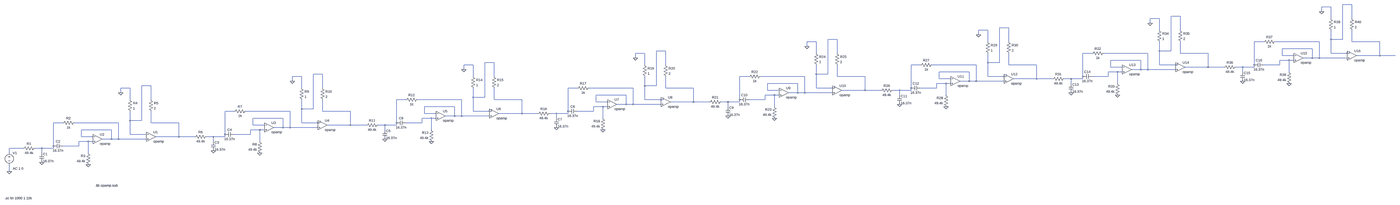
[diagram p0: schematic filter.asc, whole sheet]
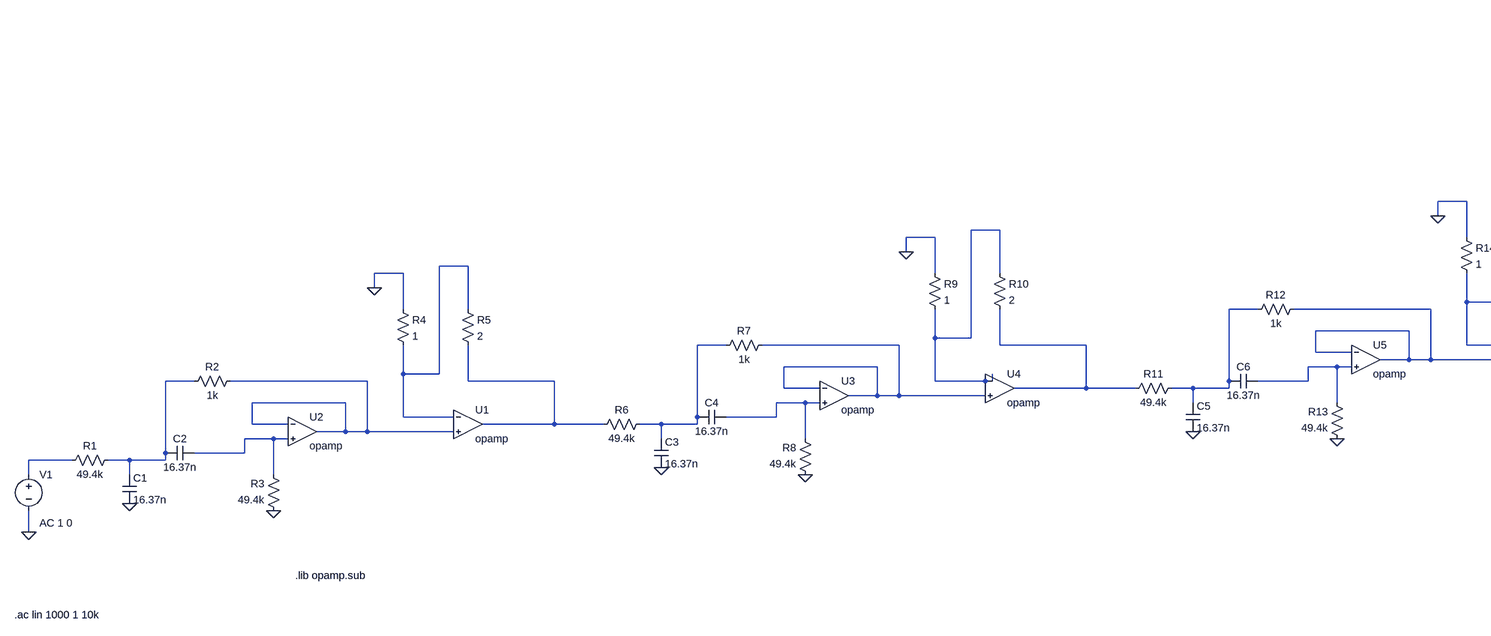
[diagram p1: schematic filter.asc, part, row 1 of 1, column 1 of 3]
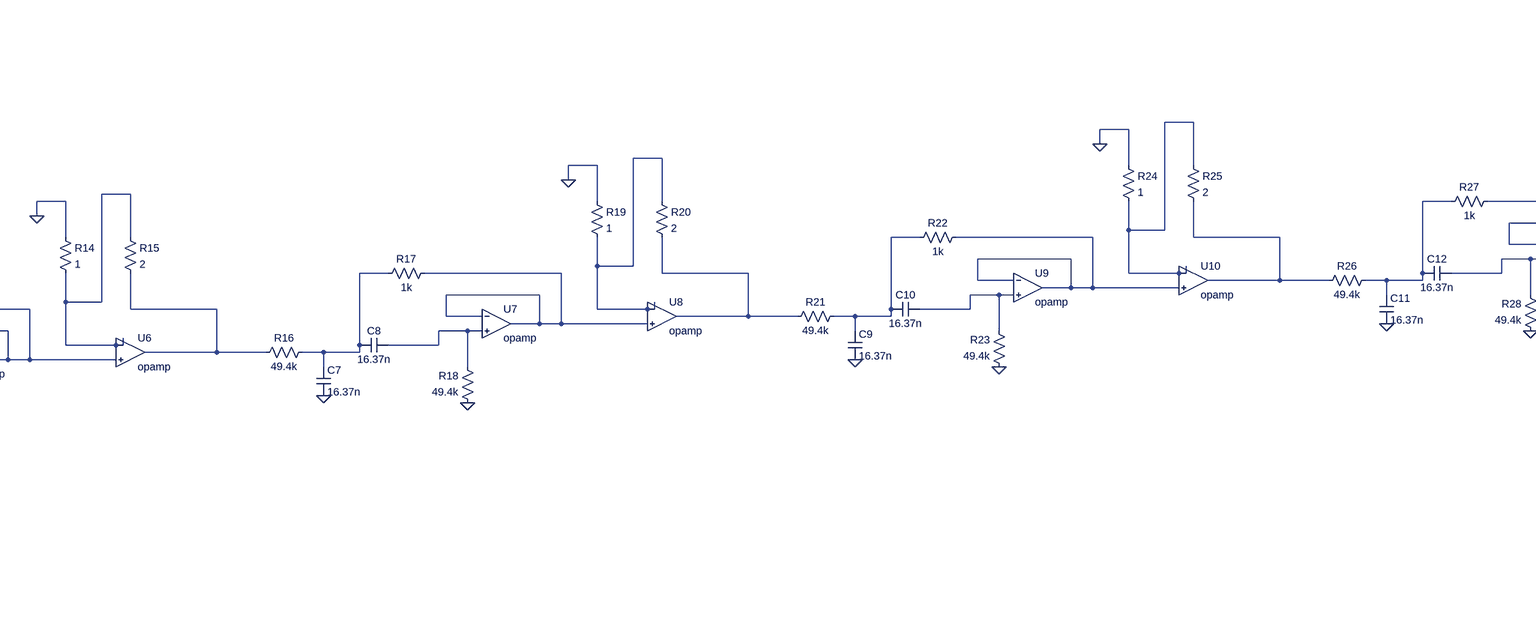
[diagram p2: schematic filter.asc, part, row 1 of 1, column 2 of 3]
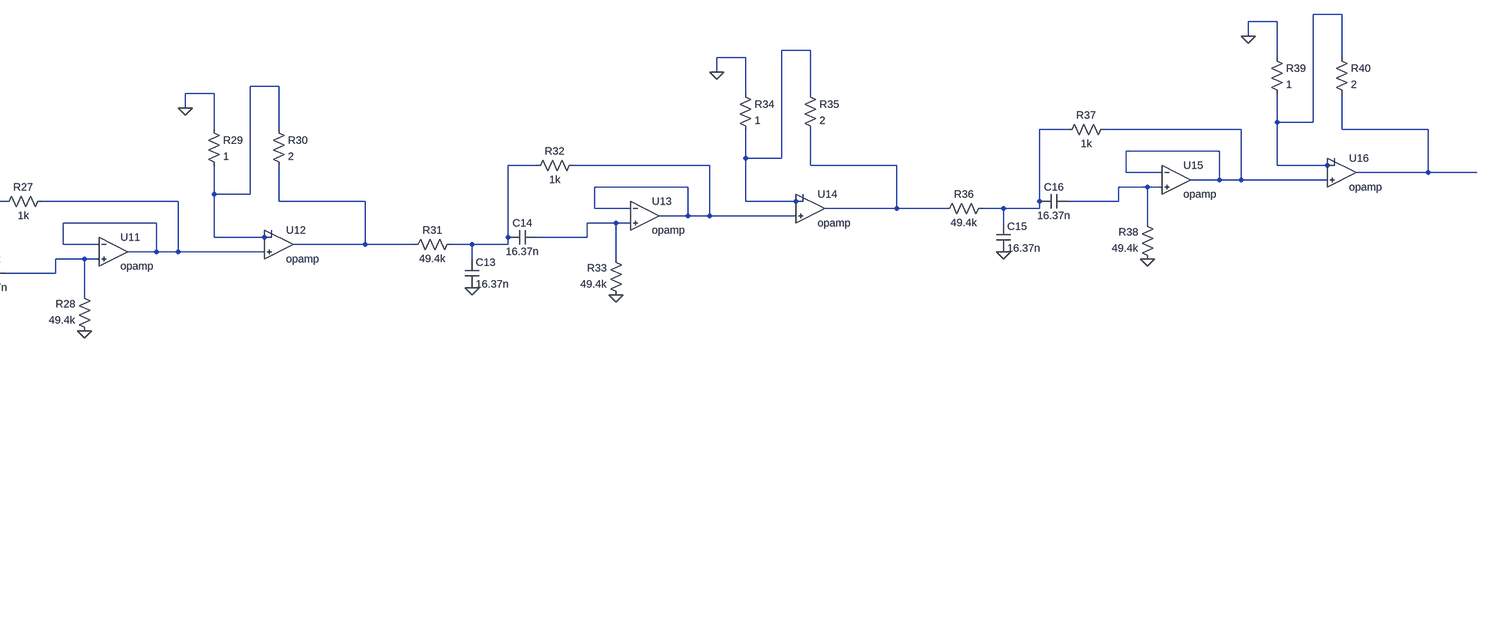
[diagram p3: schematic filter.asc, part, row 1 of 1, column 3 of 3]
filter.asc, the LTspice schematic file:
Version 4
SHEET 1 9624 680
WIRE 9248 -848 9184 -848
WIRE 9104 -832 9040 -832
WIRE 9040 -800 9040 -832
WIRE 8048 -768 7984 -768
WIRE 7904 -752 7840 -752
WIRE 9104 -752 9104 -832
WIRE 9248 -752 9248 -848
WIRE 7840 -720 7840 -752
WIRE 6848 -688 6784 -688
WIRE 6704 -672 6640 -672
WIRE 7904 -672 7904 -752
WIRE 8048 -672 8048 -768
WIRE 6640 -640 6640 -672
WIRE 5648 -608 5584 -608
WIRE 9104 -608 9104 -672
WIRE 9184 -608 9184 -848
WIRE 9184 -608 9104 -608
WIRE 5504 -592 5440 -592
WIRE 6704 -592 6704 -672
WIRE 6848 -592 6848 -688
WIRE 8640 -592 8576 -592
WIRE 9024 -592 8720 -592
WIRE 9248 -592 9248 -672
WIRE 9440 -592 9248 -592
WIRE 5440 -560 5440 -592
WIRE 8976 -544 8768 -544
WIRE 4448 -528 4384 -528
WIRE 7904 -528 7904 -592
WIRE 7984 -528 7984 -768
WIRE 7984 -528 7904 -528
WIRE 4304 -512 4240 -512
WIRE 5504 -512 5504 -592
WIRE 5648 -512 5648 -608
WIRE 7440 -512 7376 -512
WIRE 7824 -512 7520 -512
WIRE 8048 -512 8048 -592
WIRE 8240 -512 8048 -512
WIRE 9104 -512 9104 -608
WIRE 9216 -512 9104 -512
WIRE 9232 -512 9232 -528
WIRE 9232 -512 9216 -512
WIRE 8768 -496 8768 -544
WIRE 8848 -496 8768 -496
WIRE 9440 -496 9440 -592
WIRE 9440 -496 9280 -496
WIRE 9568 -496 9440 -496
WIRE 4240 -480 4240 -512
WIRE 8976 -480 8976 -544
WIRE 8976 -480 8912 -480
WIRE 9024 -480 9024 -592
WIRE 9024 -480 8976 -480
WIRE 9216 -480 9024 -480
WIRE 7776 -464 7568 -464
WIRE 8816 -464 8752 -464
WIRE 8848 -464 8816 -464
WIRE 3248 -448 3184 -448
WIRE 6704 -448 6704 -512
WIRE 6784 -448 6784 -688
WIRE 6784 -448 6704 -448
WIRE 3104 -432 3040 -432
WIRE 4304 -432 4304 -512
WIRE 4448 -432 4448 -528
WIRE 6240 -432 6176 -432
WIRE 6624 -432 6320 -432
WIRE 6848 -432 6848 -512
WIRE 7040 -432 6848 -432
WIRE 7904 -432 7904 -528
WIRE 8016 -432 7904 -432
WIRE 8032 -432 8032 -448
WIRE 8032 -432 8016 -432
WIRE 8576 -432 8576 -592
WIRE 8752 -432 8752 -464
WIRE 8752 -432 8640 -432
WIRE 7568 -416 7568 -464
WIRE 7648 -416 7568 -416
WIRE 8240 -416 8240 -512
WIRE 8240 -416 8080 -416
WIRE 8368 -416 8240 -416
WIRE 8496 -416 8448 -416
WIRE 8576 -416 8576 -432
WIRE 8576 -416 8496 -416
WIRE 3040 -400 3040 -432
WIRE 7776 -400 7776 -464
WIRE 7776 -400 7712 -400
WIRE 7824 -400 7824 -512
WIRE 7824 -400 7776 -400
WIRE 8016 -400 7824 -400
WIRE 6576 -384 6368 -384
WIRE 7616 -384 7552 -384
WIRE 7648 -384 7616 -384
WIRE 8496 -384 8496 -416
WIRE 8816 -384 8816 -464
WIRE 2048 -368 1984 -368
WIRE 5504 -368 5504 -432
WIRE 5584 -368 5584 -608
WIRE 5584 -368 5504 -368
WIRE 1904 -352 1840 -352
WIRE 3104 -352 3104 -432
WIRE 3248 -352 3248 -448
WIRE 5040 -352 4976 -352
WIRE 5424 -352 5120 -352
WIRE 5648 -352 5648 -432
WIRE 5840 -352 5648 -352
WIRE 6704 -352 6704 -448
WIRE 6816 -352 6704 -352
WIRE 6832 -352 6832 -368
WIRE 6832 -352 6816 -352
WIRE 7376 -352 7376 -512
WIRE 7552 -352 7552 -384
WIRE 7552 -352 7440 -352
WIRE 6368 -336 6368 -384
WIRE 6448 -336 6368 -336
WIRE 7040 -336 7040 -432
WIRE 7040 -336 6880 -336
WIRE 7168 -336 7040 -336
WIRE 7296 -336 7248 -336
WIRE 7376 -336 7376 -352
WIRE 7376 -336 7296 -336
WIRE 1840 -320 1840 -352
WIRE 6576 -320 6576 -384
WIRE 6576 -320 6512 -320
WIRE 6624 -320 6624 -432
WIRE 6624 -320 6576 -320
WIRE 6816 -320 6624 -320
WIRE 5376 -304 5168 -304
WIRE 6416 -304 6352 -304
WIRE 6448 -304 6416 -304
WIRE 7296 -304 7296 -336
WIRE 7616 -304 7616 -384
WIRE 848 -288 784 -288
WIRE 4304 -288 4304 -352
WIRE 4384 -288 4384 -528
WIRE 4384 -288 4304 -288
WIRE 704 -272 640 -272
WIRE 1904 -272 1904 -352
WIRE 2048 -272 2048 -368
WIRE 3840 -272 3776 -272
WIRE 4224 -272 3920 -272
WIRE 4448 -272 4448 -352
WIRE 4640 -272 4448 -272
WIRE 5504 -272 5504 -368
WIRE 5616 -272 5504 -272
WIRE 5632 -272 5632 -288
WIRE 5632 -272 5616 -272
WIRE 6176 -272 6176 -432
WIRE 6352 -272 6352 -304
WIRE 6352 -272 6240 -272
WIRE 5168 -256 5168 -304
WIRE 5248 -256 5168 -256
WIRE 5840 -256 5840 -352
WIRE 5840 -256 5680 -256
WIRE 5968 -256 5840 -256
WIRE 6096 -256 6048 -256
WIRE 6176 -256 6176 -272
WIRE 6176 -256 6096 -256
WIRE 640 -240 640 -272
WIRE 5376 -240 5376 -304
WIRE 5376 -240 5312 -240
WIRE 5424 -240 5424 -352
WIRE 5424 -240 5376 -240
WIRE 5616 -240 5424 -240
WIRE 4176 -224 3968 -224
WIRE 5216 -224 5152 -224
WIRE 5248 -224 5216 -224
WIRE 6096 -224 6096 -256
WIRE 6416 -224 6416 -304
WIRE 3104 -208 3104 -272
WIRE 3184 -208 3184 -448
WIRE 3184 -208 3104 -208
WIRE 704 -192 704 -272
WIRE 848 -192 848 -288
WIRE 2640 -192 2576 -192
WIRE 3024 -192 2720 -192
WIRE 3248 -192 3248 -272
WIRE 3440 -192 3248 -192
WIRE 4304 -192 4304 -288
WIRE 4416 -192 4304 -192
WIRE 4432 -192 4432 -208
WIRE 4432 -192 4416 -192
WIRE 4976 -192 4976 -352
WIRE 5152 -192 5152 -224
WIRE 5152 -192 5040 -192
WIRE 3968 -176 3968 -224
WIRE 4048 -176 3968 -176
WIRE 4640 -176 4640 -272
WIRE 4640 -176 4480 -176
WIRE 4768 -176 4640 -176
WIRE 4896 -176 4848 -176
WIRE 4976 -176 4976 -192
WIRE 4976 -176 4896 -176
WIRE 4176 -160 4176 -224
WIRE 4176 -160 4112 -160
WIRE 4224 -160 4224 -272
WIRE 4224 -160 4176 -160
WIRE 4416 -160 4224 -160
WIRE 2976 -144 2768 -144
WIRE 4016 -144 3952 -144
WIRE 4048 -144 4016 -144
WIRE 4896 -144 4896 -176
WIRE 5216 -144 5216 -224
WIRE 1904 -128 1904 -192
WIRE 1984 -128 1984 -368
WIRE 1984 -128 1904 -128
WIRE 1440 -112 1376 -112
WIRE 1824 -112 1520 -112
WIRE 2048 -112 2048 -192
WIRE 2240 -112 2048 -112
WIRE 3104 -112 3104 -208
WIRE 3216 -112 3104 -112
WIRE 3232 -112 3232 -128
WIRE 3232 -112 3216 -112
WIRE 3776 -112 3776 -272
WIRE 3952 -112 3952 -144
WIRE 3952 -112 3840 -112
WIRE 2768 -96 2768 -144
WIRE 2848 -96 2768 -96
WIRE 3440 -96 3440 -192
WIRE 3440 -96 3280 -96
WIRE 3568 -96 3440 -96
WIRE 3696 -96 3648 -96
WIRE 3776 -96 3776 -112
WIRE 3776 -96 3696 -96
WIRE 2976 -80 2976 -144
WIRE 2976 -80 2912 -80
WIRE 3024 -80 3024 -192
WIRE 3024 -80 2976 -80
WIRE 3216 -80 3024 -80
WIRE 1776 -64 1568 -64
WIRE 2816 -64 2752 -64
WIRE 2848 -64 2816 -64
WIRE 3696 -64 3696 -96
WIRE 4016 -64 4016 -144
WIRE 704 -48 704 -112
WIRE 784 -48 784 -288
WIRE 784 -48 704 -48
WIRE 240 -32 176 -32
WIRE 624 -32 320 -32
WIRE 848 -32 848 -112
WIRE 1040 -32 848 -32
WIRE 1904 -32 1904 -128
WIRE 2016 -32 1904 -32
WIRE 2032 -32 2032 -48
WIRE 2032 -32 2016 -32
WIRE 2576 -32 2576 -192
WIRE 2752 -32 2752 -64
WIRE 2752 -32 2640 -32
WIRE 1568 -16 1568 -64
WIRE 1648 -16 1568 -16
WIRE 2240 -16 2240 -112
WIRE 2240 -16 2080 -16
WIRE 2368 -16 2240 -16
WIRE 2496 -16 2448 -16
WIRE 2576 -16 2576 -32
WIRE 2576 -16 2496 -16
WIRE 1776 0 1776 -64
WIRE 1776 0 1712 0
WIRE 1824 0 1824 -112
WIRE 1824 0 1776 0
WIRE 2016 0 1824 0
WIRE 576 16 368 16
WIRE 1616 16 1552 16
WIRE 1648 16 1616 16
WIRE 2496 16 2496 -16
WIRE 2816 16 2816 -64
WIRE 704 48 704 -48
WIRE 816 48 704 48
WIRE 1376 48 1376 -112
WIRE 1552 48 1552 16
WIRE 1552 48 1440 48
WIRE 368 64 368 16
WIRE 448 64 368 64
WIRE 1040 64 1040 -32
WIRE 1040 64 880 64
WIRE 1168 64 1040 64
WIRE 1296 64 1248 64
WIRE 1376 64 1376 48
WIRE 1376 64 1296 64
WIRE 576 80 576 16
WIRE 576 80 512 80
WIRE 624 80 624 -32
WIRE 624 80 576 80
WIRE 816 80 624 80
WIRE 416 96 352 96
WIRE 448 96 416 96
WIRE 1296 96 1296 64
WIRE 1616 96 1616 16
WIRE 176 128 176 -32
WIRE 352 128 352 96
WIRE 352 128 240 128
WIRE -32 144 -128 144
WIRE 96 144 48 144
WIRE 176 144 176 128
WIRE 176 144 96 144
WIRE -128 176 -128 144
WIRE 96 176 96 144
WIRE 416 176 416 96
WIRE -128 304 -128 256
FLAG 96 240 0
FLAG 416 256 0
FLAG 640 -240 0
FLAG 1296 160 0
FLAG 1616 176 0
FLAG 1840 -320 0
FLAG 2496 80 0
FLAG 2816 96 0
FLAG 3040 -400 0
FLAG 3696 0 0
FLAG 4016 16 0
FLAG 4240 -480 0
FLAG 4896 -80 0
FLAG 5216 -64 0
FLAG 5440 -560 0
FLAG 6096 -160 0
FLAG 6416 -144 0
FLAG 6640 -640 0
FLAG 7296 -240 0
FLAG 7616 -224 0
FLAG 7840 -720 0
FLAG 8496 -320 0
FLAG 8816 -304 0
FLAG 9040 -800 0
FLAG -128 304 0
SYMBOL cap 80 176 R0
SYMATTR InstName C1
SYMATTR Value 16.37n
SYMBOL res 64 128 R90
WINDOW 0 0 56 VBottom 2
WINDOW 3 32 56 VTop 2
SYMATTR InstName R1
SYMATTR Value 49.4k
SYMBOL cap 240 112 R90
WINDOW 0 0 32 VBottom 2
WINDOW 3 32 32 VTop 2
SYMATTR InstName C2
SYMATTR Value 16.37n
SYMBOL res 336 -48 R90
WINDOW 0 0 56 VBottom 2
WINDOW 3 32 56 VTop 2
SYMATTR InstName R2
SYMATTR Value 1k
SYMBOL res 432 272 R180
WINDOW 0 36 76 Left 2
WINDOW 3 36 40 Left 2
SYMATTR InstName R3
SYMATTR Value 49.4k
SYMBOL OpAmps\\opamp 480 16 R0
SYMATTR InstName U2
SYMBOL res 688 -208 R0
SYMATTR InstName R4
SYMATTR Value 1
SYMBOL res 832 -208 R0
SYMATTR InstName R5
SYMATTR Value 2
SYMBOL cap 1280 96 R0
SYMATTR InstName C3
SYMATTR Value 16.37n
SYMBOL res 1264 48 R90
WINDOW 0 0 56 VBottom 2
WINDOW 3 32 56 VTop 2
SYMATTR InstName R6
SYMATTR Value 49.4k
SYMBOL cap 1440 32 R90
WINDOW 0 0 32 VBottom 2
WINDOW 3 32 32 VTop 2
SYMATTR InstName C4
SYMATTR Value 16.37n
SYMBOL res 1536 -128 R90
WINDOW 0 0 56 VBottom 2
WINDOW 3 32 56 VTop 2
SYMATTR InstName R7
SYMATTR Value 1k
SYMBOL res 1632 192 R180
WINDOW 0 36 76 Left 2
WINDOW 3 36 40 Left 2
SYMATTR InstName R8
SYMATTR Value 49.4k
SYMBOL OpAmps\\opamp 1680 -64 R0
SYMATTR InstName U3
SYMBOL OpAmps\\opamp 2048 -80 R0
SYMATTR InstName U4
SYMBOL res 1888 -288 R0
SYMATTR InstName R9
SYMATTR Value 1
SYMBOL res 2032 -288 R0
SYMATTR InstName R10
SYMATTR Value 2
SYMBOL cap 2480 16 R0
SYMATTR InstName C5
SYMATTR Value 16.37n
SYMBOL res 2464 -32 R90
WINDOW 0 0 56 VBottom 2
WINDOW 3 32 56 VTop 2
SYMATTR InstName R11
SYMATTR Value 49.4k
SYMBOL cap 2640 -48 R90
WINDOW 0 0 32 VBottom 2
WINDOW 3 32 32 VTop 2
SYMATTR InstName C6
SYMATTR Value 16.37n
SYMBOL res 2736 -208 R90
WINDOW 0 0 56 VBottom 2
WINDOW 3 32 56 VTop 2
SYMATTR InstName R12
SYMATTR Value 1k
SYMBOL res 2832 112 R180
WINDOW 0 36 76 Left 2
WINDOW 3 36 40 Left 2
SYMATTR InstName R13
SYMATTR Value 49.4k
SYMBOL OpAmps\\opamp 2880 -144 R0
SYMATTR InstName U5
SYMBOL OpAmps\\opamp 3248 -160 R0
SYMATTR InstName U6
SYMBOL res 3088 -368 R0
SYMATTR InstName R14
SYMATTR Value 1
SYMBOL res 3232 -368 R0
SYMATTR InstName R15
SYMATTR Value 2
SYMBOL cap 3680 -64 R0
SYMATTR InstName C7
SYMATTR Value 16.37n
SYMBOL res 3664 -112 R90
WINDOW 0 0 56 VBottom 2
WINDOW 3 32 56 VTop 2
SYMATTR InstName R16
SYMATTR Value 49.4k
SYMBOL cap 3840 -128 R90
WINDOW 0 0 32 VBottom 2
WINDOW 3 32 32 VTop 2
SYMATTR InstName C8
SYMATTR Value 16.37n
SYMBOL res 3936 -288 R90
WINDOW 0 0 56 VBottom 2
WINDOW 3 32 56 VTop 2
SYMATTR InstName R17
SYMATTR Value 1k
SYMBOL res 4032 32 R180
WINDOW 0 36 76 Left 2
WINDOW 3 36 40 Left 2
SYMATTR InstName R18
SYMATTR Value 49.4k
SYMBOL OpAmps\\opamp 4080 -224 R0
SYMATTR InstName U7
SYMBOL OpAmps\\opamp 4448 -240 R0
SYMATTR InstName U8
SYMBOL res 4288 -448 R0
SYMATTR InstName R19
SYMATTR Value 1
SYMBOL res 4432 -448 R0
SYMATTR InstName R20
SYMATTR Value 2
SYMBOL cap 4880 -144 R0
SYMATTR InstName C9
SYMATTR Value 16.37n
SYMBOL res 4864 -192 R90
WINDOW 0 0 56 VBottom 2
WINDOW 3 32 56 VTop 2
SYMATTR InstName R21
SYMATTR Value 49.4k
SYMBOL cap 5040 -208 R90
WINDOW 0 0 32 VBottom 2
WINDOW 3 32 32 VTop 2
SYMATTR InstName C10
SYMATTR Value 16.37n
SYMBOL res 5136 -368 R90
WINDOW 0 0 56 VBottom 2
WINDOW 3 32 56 VTop 2
SYMATTR InstName R22
SYMATTR Value 1k
SYMBOL res 5232 -48 R180
WINDOW 0 36 76 Left 2
WINDOW 3 36 40 Left 2
SYMATTR InstName R23
SYMATTR Value 49.4k
SYMBOL OpAmps\\opamp 5280 -304 R0
SYMATTR InstName U9
SYMBOL OpAmps\\opamp 5648 -320 R0
SYMATTR InstName U10
SYMBOL res 5488 -528 R0
SYMATTR InstName R24
SYMATTR Value 1
SYMBOL res 5632 -528 R0
SYMATTR InstName R25
SYMATTR Value 2
SYMBOL cap 6080 -224 R0
SYMATTR InstName C11
SYMATTR Value 16.37n
SYMBOL res 6064 -272 R90
WINDOW 0 0 56 VBottom 2
WINDOW 3 32 56 VTop 2
SYMATTR InstName R26
SYMATTR Value 49.4k
SYMBOL cap 6240 -288 R90
WINDOW 0 0 32 VBottom 2
WINDOW 3 32 32 VTop 2
SYMATTR InstName C12
SYMATTR Value 16.37n
SYMBOL res 6336 -448 R90
WINDOW 0 0 56 VBottom 2
WINDOW 3 32 56 VTop 2
SYMATTR InstName R27
SYMATTR Value 1k
SYMBOL res 6432 -128 R180
WINDOW 0 36 76 Left 2
WINDOW 3 36 40 Left 2
SYMATTR InstName R28
SYMATTR Value 49.4k
SYMBOL OpAmps\\opamp 6480 -384 R0
SYMATTR InstName U11
SYMBOL OpAmps\\opamp 6848 -400 R0
SYMATTR InstName U12
SYMBOL res 6688 -608 R0
SYMATTR InstName R29
SYMATTR Value 1
SYMBOL res 6832 -608 R0
SYMATTR InstName R30
SYMATTR Value 2
SYMBOL cap 7280 -304 R0
SYMATTR InstName C13
SYMATTR Value 16.37n
SYMBOL res 7264 -352 R90
WINDOW 0 0 56 VBottom 2
WINDOW 3 32 56 VTop 2
SYMATTR InstName R31
SYMATTR Value 49.4k
SYMBOL cap 7440 -368 R90
WINDOW 0 0 32 VBottom 2
WINDOW 3 32 32 VTop 2
SYMATTR InstName C14
SYMATTR Value 16.37n
SYMBOL res 7536 -528 R90
WINDOW 0 0 56 VBottom 2
WINDOW 3 32 56 VTop 2
SYMATTR InstName R32
SYMATTR Value 1k
SYMBOL res 7632 -208 R180
WINDOW 0 36 76 Left 2
WINDOW 3 36 40 Left 2
SYMATTR InstName R33
SYMATTR Value 49.4k
SYMBOL OpAmps\\opamp 7680 -464 R0
SYMATTR InstName U13
SYMBOL OpAmps\\opamp 8048 -480 R0
SYMATTR InstName U14
SYMBOL res 7888 -688 R0
SYMATTR InstName R34
SYMATTR Value 1
SYMBOL res 8032 -688 R0
SYMATTR InstName R35
SYMATTR Value 2
SYMBOL cap 8480 -384 R0
SYMATTR InstName C15
SYMATTR Value 16.37n
SYMBOL res 8464 -432 R90
WINDOW 0 0 56 VBottom 2
WINDOW 3 32 56 VTop 2
SYMATTR InstName R36
SYMATTR Value 49.4k
SYMBOL cap 8640 -448 R90
WINDOW 0 0 32 VBottom 2
WINDOW 3 32 32 VTop 2
SYMATTR InstName C16
SYMATTR Value 16.37n
SYMBOL res 8736 -608 R90
WINDOW 0 0 56 VBottom 2
WINDOW 3 32 56 VTop 2
SYMATTR InstName R37
SYMATTR Value 1k
SYMBOL res 8832 -288 R180
WINDOW 0 36 76 Left 2
WINDOW 3 36 40 Left 2
SYMATTR InstName R38
SYMATTR Value 49.4k
SYMBOL OpAmps\\opamp 8880 -544 R0
SYMATTR InstName U15
SYMBOL OpAmps\\opamp 9248 -560 R0
SYMATTR InstName U16
SYMBOL res 9088 -768 R0
SYMATTR InstName R39
SYMATTR Value 1
SYMBOL res 9232 -768 R0
SYMATTR InstName R40
SYMATTR Value 2
SYMBOL OpAmps\\opamp 848 0 R0
SYMATTR InstName U1
SYMBOL voltage -128 160 R0
WINDOW 123 24 124 Left 2
WINDOW 39 0 0 Left 0
SYMATTR InstName V1
SYMATTR Value ""
SYMATTR Value2 AC 1 0
TEXT 464 400 Left 2 !.lib opamp.sub
TEXT -160 488 Left 2 !.ac lin 1000 1 10k

The netlist it stands for:
* filter.asc
C1 N036 0 16.37n
R1 N036 N041 49.4k
C2 N040 N036 16.37n
R2 N037 N036 1k
R3 0 N040 49.4k
XU2 N037 N040 N037 opamp Aol=100K GBW=10Meg  ; pins invin noninvin out
R4 0 N023 1
R5 N023 N038 2
C3 N032 0 16.37n
R6 N032 N038 49.4k
C4 N039 N032 16.37n
R7 N033 N032 1k
R8 0 N039 49.4k
XU3 N033 N039 N033 opamp Aol=100K GBW=10Meg  ; pins invin noninvin out
XU4 N018 N033 N034 opamp Aol=100K GBW=10Meg  ; pins invin noninvin out
R9 0 N018 1
R10 N018 N034 2
C5 N028 0 16.37n
R11 N028 N034 49.4k
C6 N035 N028 16.37n
R12 N029 N028 1k
R13 0 N035 49.4k
XU5 N029 N035 N029 opamp Aol=100K GBW=10Meg  ; pins invin noninvin out
XU6 N013 N029 N030 opamp Aol=100K GBW=10Meg  ; pins invin noninvin out
R14 0 N013 1
R15 N013 N030 2
C7 N024 0 16.37n
R16 N024 N030 49.4k
C8 N031 N024 16.37n
R17 N025 N024 1k
R18 0 N031 49.4k
XU7 N025 N031 N025 opamp Aol=100K GBW=10Meg  ; pins invin noninvin out
XU8 N008 N025 N026 opamp Aol=100K GBW=10Meg  ; pins invin noninvin out
R19 0 N008 1
R20 N008 N026 2
C9 N019 0 16.37n
R21 N019 N026 49.4k
C10 N027 N019 16.37n
R22 N020 N019 1k
R23 0 N027 49.4k
XU9 N020 N027 N020 opamp Aol=100K GBW=10Meg  ; pins invin noninvin out
XU10 N004 N020 N021 opamp Aol=100K GBW=10Meg  ; pins invin noninvin out
R24 0 N004 1
R25 N004 N021 2
C11 N014 0 16.37n
R26 N014 N021 49.4k
C12 N022 N014 16.37n
R27 N015 N014 1k
R28 0 N022 49.4k
XU11 N015 N022 N015 opamp Aol=100K GBW=10Meg  ; pins invin noninvin out
XU12 N003 N015 N016 opamp Aol=100K GBW=10Meg  ; pins invin noninvin out
R29 0 N003 1
R30 N003 N016 2
C13 N009 0 16.37n
R31 N009 N016 49.4k
C14 N017 N009 16.37n
R32 N010 N009 1k
R33 0 N017 49.4k
XU13 N010 N017 N010 opamp Aol=100K GBW=10Meg  ; pins invin noninvin out
XU14 N002 N010 N011 opamp Aol=100K GBW=10Meg  ; pins invin noninvin out
R34 0 N002 1
R35 N002 N011 2
C15 N005 0 16.37n
R36 N005 N011 49.4k
C16 N012 N005 16.37n
R37 N006 N005 1k
R38 0 N012 49.4k
XU15 N006 N012 N006 opamp Aol=100K GBW=10Meg  ; pins invin noninvin out
XU16 N001 N006 N007 opamp Aol=100K GBW=10Meg  ; pins invin noninvin out
R39 0 N001 1
R40 N001 N007 2
XU1 N023 N037 N038 opamp Aol=100K GBW=10Meg  ; pins invin noninvin out
V1 N041 0 AC 1 0
.lib opamp.sub
.ac lin 1000 1 10k
.backanno
.end